# EAGLE design dekatron-sim-4017-a4 (EAGLE 7.6.0)
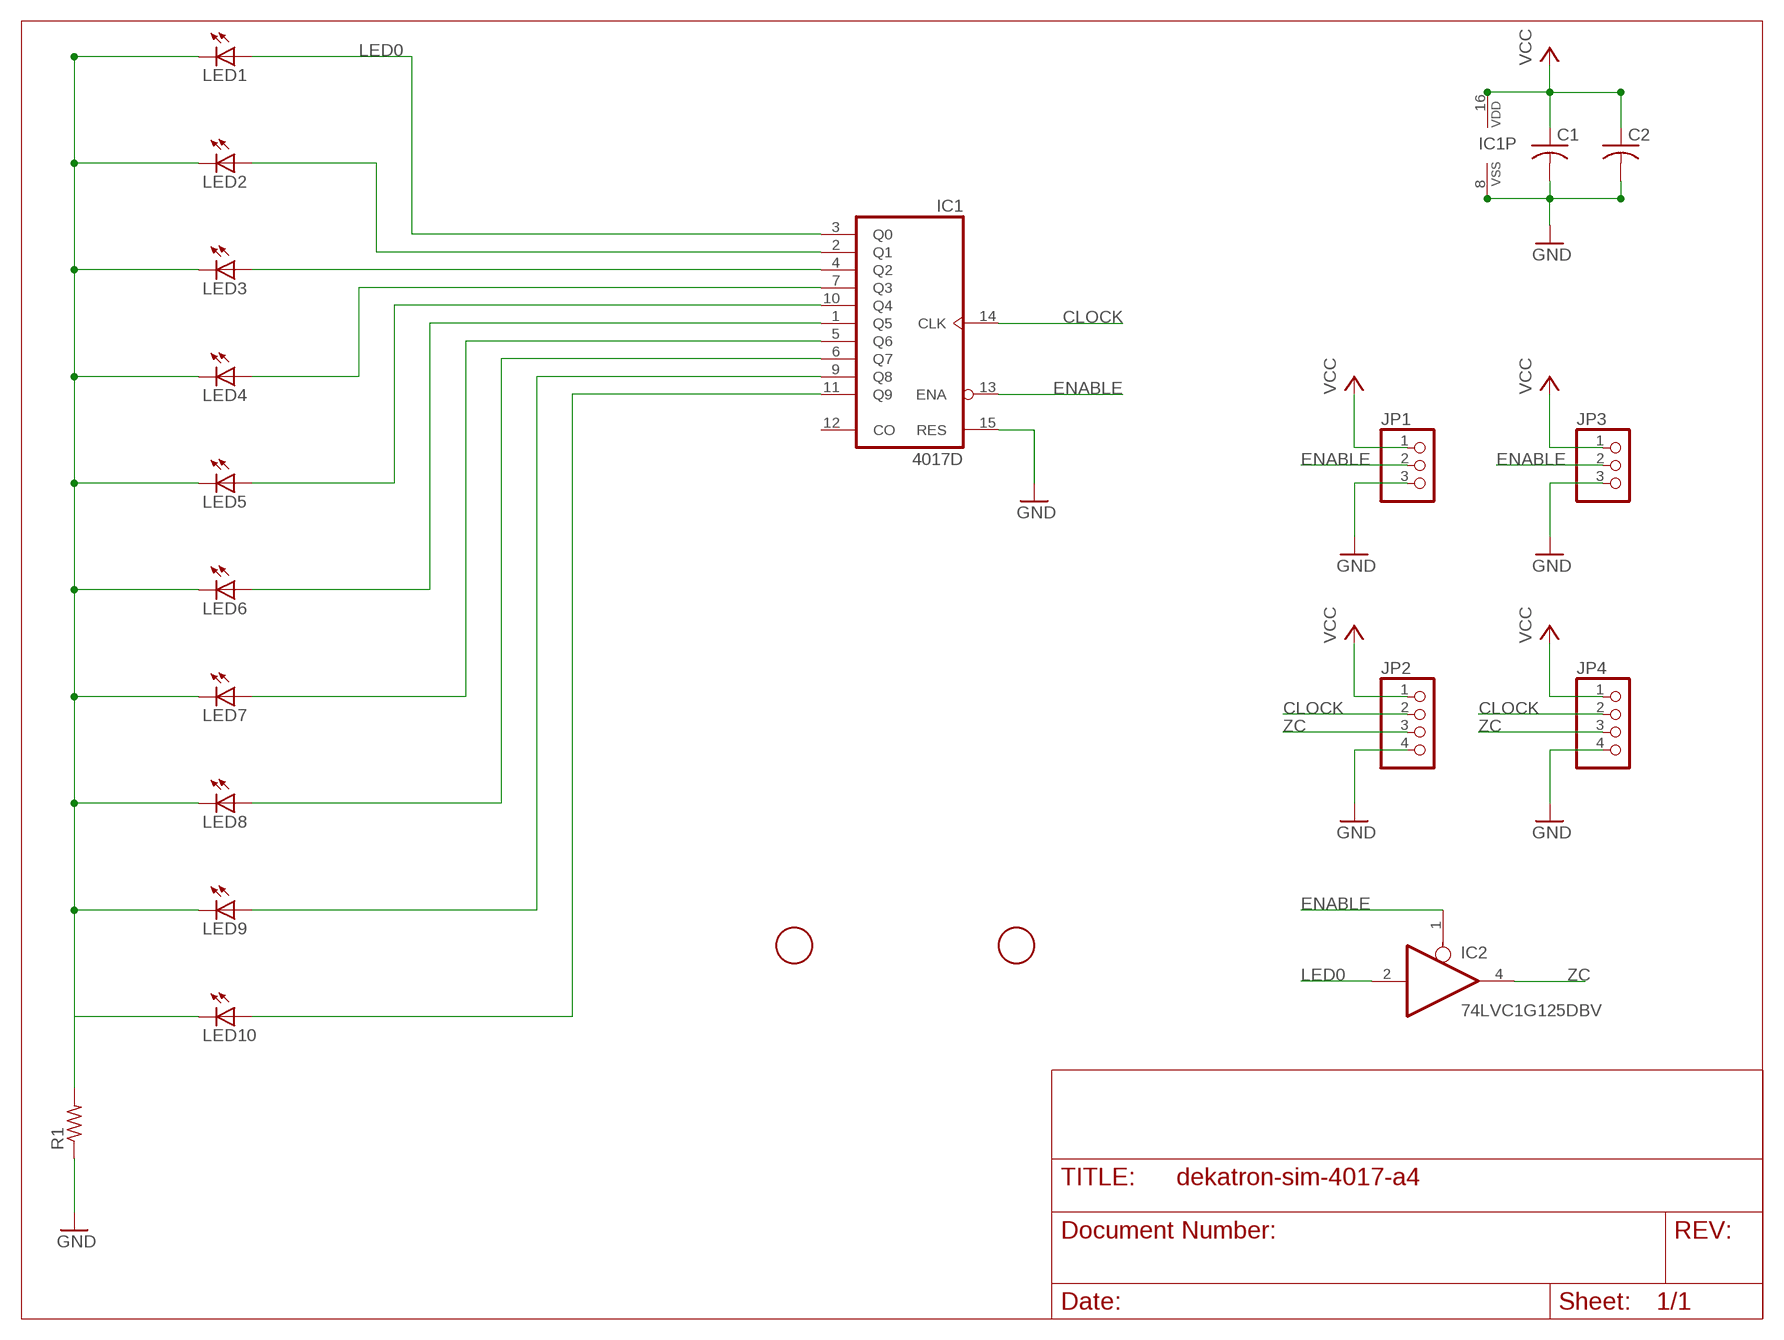
[diagram p0: schematic, sheet 1]

## Parts
C1  C-USC0805  [C0805]
C2  C-USC0805  [C0805]
FID1  FIDUCIAL  [FIDUCIAL_1MM]
FID2  FIDUCIAL  [FIDUCIAL_1MM]
IC1  4017D  [SO16]
IC2  74LVC1G125DBV  [SOT23-5]
JP1  PINHD-1X3  [1X03]
JP2  PINHD-1X4  [1X04]
JP3  PINHD-1X3  [1X03]
JP4  PINHD-1X4  [1X04]
LED1  RED  LEDCHIP-LED0805  [CHIP-LED0805]
LED2  RED  LEDCHIP-LED0805  [CHIP-LED0805]
LED3  RED  LEDCHIP-LED0805  [CHIP-LED0805]
LED4  RED  LEDCHIP-LED0805  [CHIP-LED0805]
LED5  RED  LEDCHIP-LED0805  [CHIP-LED0805]
LED6  RED  LEDCHIP-LED0805  [CHIP-LED0805]
LED7  RED  LEDCHIP-LED0805  [CHIP-LED0805]
LED8  RED  LEDCHIP-LED0805  [CHIP-LED0805]
LED9  RED  LEDCHIP-LED0805  [CHIP-LED0805]
LED10  RED  LEDCHIP-LED0805  [CHIP-LED0805]
R1  R-US_R0805  [R0805]

## Nets
CLOCK: IC1.14(CLK) JP2.2 JP4.2
ENABLE: IC1.13(ENA) IC2.1(OE) JP1.2 JP3.2
GND: C1.2 C2.2 IC1.8(VSS) IC1.15(RES) JP1.3 JP2.4 JP3.3 JP4.4 R1.1
LED0: IC1.3(Q0) IC2.2(I) LED1.A
LED1: IC1.2(Q1) LED2.A
LED3: IC1.7(Q3) LED4.A
LED4: IC1.10(Q4) LED5.A
LED5: IC1.1(Q5) LED6.A
LED6: IC1.5(Q6) LED7.A
LED7: IC1.6(Q7) LED8.A
LED8: IC1.9(Q8) LED9.A
LED9: IC1.11(Q9) LED10.A
LED_SINK: LED1.C LED2.C LED3.C LED4.C LED5.C LED6.C LED7.C LED8.C LED9.C LED10.C R1.2
N$1: IC1.4(Q2) LED3.A
VCC: C1.1 C2.1 IC1.16(VDD) JP1.1 JP2.1 JP3.1 JP4.1
ZC: IC2.4(O) JP2.3 JP4.3
Unconnected: IC1.12(CO)

## Power pins joined to a net without a drawn wire
GND: IC2.3(GND)
VCC: IC2.5(VCC)

## Library data of the parts
C1 C2 = resistor:C-US: CAPACITOR, American symbol
FID1 FID2 = adafruit:FIDUCIAL: For use by pick and place machines to calibrate the vision/machine, 1mm By microbuilder.eu
IC1 = 40xx:4017: COUNTER/DIVIDER
IC2 = 74xx-little-us:74*1G125: Single Bus Buffer Gate with 3-State Output
JP1 JP3 = pinhead:PINHD-1X3: PIN HEADER
JP2 JP4 = pinhead:PINHD-1X4: PIN HEADER
LED1-LED10 = led:LED: LED OSRAM: - CHIPLED LG R971, LG N971, LY N971, LG Q971, LY Q971, LO R971, LY R971 LH N974, LH R974 LS Q976, LO Q976, LY Q976 LO Q996 - Hyper CHIPLED LW Q18S LB Q993, LB Q99A, LB R99A - SideLED LS A670, LO A670, LY A670, LG A670, LP A670 LB A673, LV A673, LT A673, LW A673 LH A674 LY A675 LS A676, LA A676, LO A676, LY A676, LW A676 LS A679, LY A679, LG A679 - Hyper Micro SIDELED® LS Y876, LA Y876, LO Y876, LY Y876 LT Y87S - SmartLED LW L88C, LW L88S LB L89C, LB L89S, LG L890 LS L89K, LO L89K, LY L89K LS L896, LA L896, LO L896, LY L896 - TOPLED LS T670, LO T670, LY T670, LG T670, LP T670 LSG T670, LSP T670, LSY T670, LOP T670, LYG T670 LG T671, LOG T671, LSG T671 LB T673, LV T673, LT T673, LW T673 LH T674 LS T676, LA T676, LO T676, LY T676, LB T676, LH T676, LSB T676, LW T676 LB T67C, LV T67C, LT T67C, LS T67K, LO T67K, LY T67K, LW E67C LS E67B, LA E67B, LO E67B, LY E67B, LB E67C, LV E67C, LT E67C LW T67C LS T679, LY T679, LG T679 LS T770, LO T770, LY T770, LG T770, LP T770 LB T773, LV T773, LT T773, LW T773 LH T774 LS E675, LA E675, LY E675, LS T675 LS T776, LA T776, LO T776, LY T776, LB T776 LHGB T686 LT T68C, LB T68C - Hyper Mini TOPLED® LB M676 - Mini TOPLED Santana® LG M470 LS M47K, LO M47K, LY M47K Source: http://www.osram.convergy.de LUXEON: - LUMILED® LXK2-PW12-R00, LXK2-PW12-S00, LXK2-PW14-U00, LXK2-PW14-V00 LXK2-PM12-R00, LXK2-PM12-S00, LXK2-PM14-U00 LXK2-PE12-Q00, LXK2-PE12-R00, LXK2-PE12-S00, LXK2-PE14-T00, LXK2-PE14-U00 LXK2-PB12-K00, LXK2-PB12-L00, LXK2-PB12-M00, LXK2-PB14-N00, LXK2-PB14-P00, LXK2-PB14-Q00 LXK2-PR12-L00, LXK2-PR12-M00, LXK2-PR14-Q00, LXK2-PR14-R00 LXK2-PD12-Q00, LXK2-PD12-R00, LXK2-PD12-S00 LXK2-PH12-R00, LXK2-PH12-S00 LXK2-PL12-P00, LXK2-PL12-Q00, LXK2-PL12-R00 Source: www.luxeon.com KINGBRIGHT: KA-3528ASYC Source: www.kingbright.com
R1 = resistor:R-US_: RESISTOR, American symbol

## Board
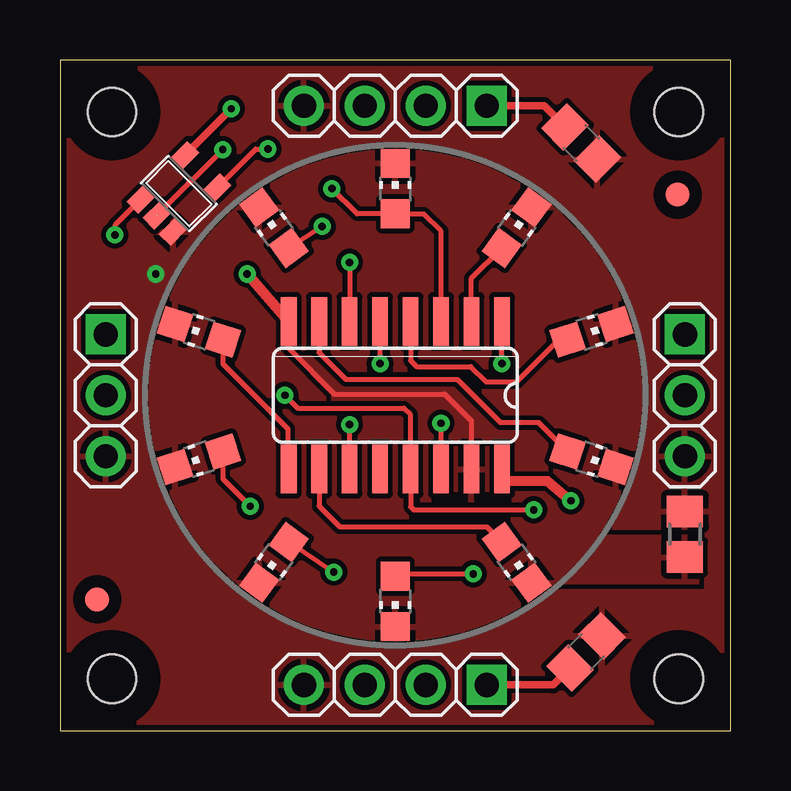
[diagram p1: board, top side]
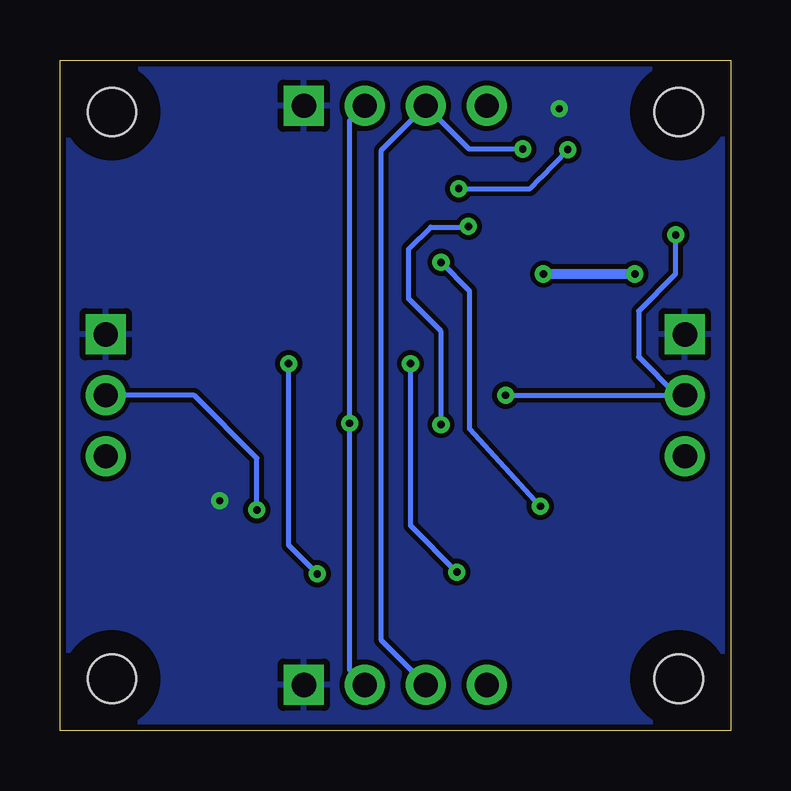
[diagram p2: board, bottom side, seen from below]

Size 27.94 x 27.94 mm. Coordinates in mm from the lower left corner, seen from the top.
Outline: 27.94,27.94 0,27.94 0,0 27.94,0 27.94,27.94
Copper layers (1*16): Top 0.035mm / dielectric 1.5mm / Bottom 0.035mm
Design rules "default *": minimum track width 8mil, minimum drill 12mil, track to track 8mil, track to pad 10mil, pad to pad 10mil, via to via 8mil, smd to smd 8mil, copper to edge 10mil, drill to drill 8mil, minimum pad ring 10mil, minimum via ring 8mil, stop-mask expansion 4mil, vias tented up to drill 0mil, thermal gap 10mil
Holes 2.01 mm at 2.16,2.16 25.78,2.16 25.78,25.78 2.16,25.78
tRestrict: area 23.8,0.2 to 27.8,4.2; area 23.8,23.8 to 27.8,27.8; area 0.2,23.8 to 4.2,27.8; area 0.2,0.2 to 4.2,4.2
bRestrict: area 23.8,0.2 to 27.8,4.2; area 23.8,23.8 to 27.8,27.8; area 0.2,23.8 to 4.2,27.8; area 0.2,0.2 to 4.2,4.2

### Footprints (pad centres in the part's own frame; a part is rotated, then mirrored left to right if it is on the bottom)
C0805 = smd 1.3 x 1.5: 1 -0.95,0; 2 0.95,0
FIDUCIAL_1MM = smd 1 x 1: 1 0,0
SO16 = smd 0.66 x 2.032: 1 -4.445,-3.073; 2 -3.175,-3.073; 3 -1.905,-3.073; 4 -0.635,-3.073; 5 0.635,-3.073; 6 1.905,-3.073; 7 3.175,-3.073; 8 4.445,-3.073; 9 4.445,3.073; 10 3.175,3.073; 11 1.905,3.073; 12 0.635,3.073; 13 -0.635,3.073; 14 -1.905,3.073; 15 -3.175,3.073; 16 -4.445,3.073
SOT23-5 = smd 0.69 x 0.99: 1 -0.95,-1.29; 2 0,-1.29; 3 0.95,-1.29; 4 0.95,1.3; 5 -0.95,1.3
1X03 = drill 1.016 pad 1.676 square: 1 -2.54,0 | drill 1.016 pad 1.676: 2 0,0; 3 2.54,0
1X04 = drill 1.016 pad 1.676 square: 1 -3.81,0 | drill 1.016 pad 1.676: 2 -1.27,0; 3 1.27,0; 4 3.81,0
CHIP-LED0805 = smd 1.2 x 1.2: A 0,-1.05; C 0,1.05
R0805 = smd 1.3 x 1.5: 1 -0.95,0; 2 0.95,0

### Placement (x,y rotation side)
C1  21.72,24.49 315 top
C2  21.92,3.28 45 top
FID1  25.73,22.33 0 top
FID2  1.55,5.46 0 top
IC1  13.97,13.97 180 top
IC2  4.95,22.38 315 top
JP1  1.91,13.97 270 top
JP2  13.97,26.04 180 top
JP3  26.04,13.97 270 top
JP4  13.97,1.91 180 top
LED1  13.97,22.58 0 top
LED2  19.02,20.95 324 top
LED3  22.15,16.61 288 top
LED4  22.15,11.3 252 top
LED5  19.02,7.01 216 top
LED6  13.97,5.38 180 top
LED7  8.92,7.01 144 top
LED8  5.79,11.3 108 top
LED9  5.79,16.61 72 top
LED10  8.92,20.95 36 top
R1  26.04,8.18 270 top

### Tracks (layer width: path | path; a pad name or v marks a point on that pad's centre or on a via)
CLOCK  (via drill 0.3)
  Top 0.203: IC1.14 v15.88,12.8
  Bottom 0.203: JP4.2 15.88,2.52 v15.88,12.8 15.88,25.43 JP2.2
ENABLE  (via drill 0.3)
  Top 0.203: v19.74,9.2 14.73,9.2 14.61,9.32 IC1.13 14.61,13.16 14.33,13.44 9.91,13.44 v9.37,13.97 | IC2.1 2.29,21.05 v2.29,20.65
  Bottom 0.203: 2.72,13.97 JP1.2 | v9.37,13.97 JP1.2 | JP1.2 2.39,13.97 | v19.74,9.2 19.74,11.35 22.35,13.97 JP3.2 | JP1.2 2.23,13.97 3.83,15.57 3.83,17.48 2.29,19.02 v2.29,20.65
GND  (via drill 0.3)
  Top 0.203: IC1.8 9.53,15.93 11.43,14.02 16.03,14.02 17.14,12.9 IC1.15
  Top 0.406: IC1.8 v7.8,19.02
  Bottom 0.406: v7.8,19.02 v3.99,19.02
  pour Top (rank 6): 27.69,0.25 0.25,0.25 0.25,27.69 27.69,27.69
LED0  (via drill 0.3)
  Top 0.203: IC1.3 15.88,20.8 15.16,21.51 13.99,21.51 LED1.A 12.38,21.53 v11.33,22.58 | IC2.2 v6.78,24.21
  Bottom 0.203: v6.78,24.21 7.9,23.04 8.36,22.58 v11.33,22.58
LED1
  Top 0.203: IC1.2 17.14,18.84 LED2.A
LED3
  Top 0.203: IC1.7 10.79,15.75 11.91,14.63 16.56,14.63 18.36,12.83 19.95,12.83 LED4.A
LED4
  Top 0.203: IC1.10 10.79,9.35 11.66,8.48 17.78,8.48 LED5.A
LED5  (via drill 0.3)
  Top 0.203: LED6.A 14.06,6.53 v17.22,6.53 | v18.41,15.29 IC1.1
  Bottom 0.203: v17.22,6.53 18.41,7.72 v18.41,15.29
LED6  (via drill 0.3)
  Top 0.203: LED7.A v11.4,6.6 | v13.34,15.29 IC1.5
  Bottom 0.203: v11.4,6.6 13.34,8.53 v13.34,15.29
LED7  (via drill 0.3)
  Top 0.203: LED8.A 6.79,10.48 v7.92,9.35 | v12.06,19.51 IC1.6
  Bottom 0.203: v7.92,9.35 10.87,12.57 10.87,18.31 v12.06,19.51
LED8
  Top 0.203: LED9.A 6.79,15.28 9.5,12.57 9.5,10.92 IC1.9
LED9  (via drill 0.3)
  Top 0.203: IC1.11 v12.06,12.75 | v10.92,21.01 LED10.A
  Bottom 0.203: v12.06,12.75 12.06,16.64 13.41,17.98 13.41,20.07 12.5,20.98 10.95,20.98 v10.92,21.01
LED_SINK
  pour Top: 26.54,8.05 26.54,6.2 20.6,6.2 20.6,8.05
  pour Top (rank 4): 13.97,24.13 arc-90 24.13,13.97 arc-90 13.97,3.81 arc-90 3.81,13.97 arc-90
N$1
  Top 0.203: IC1.4 14.61,15.42 14.86,15.16 17.12,15.16 17.75,14.53 19.02,14.53 20.78,16.29 LED3.A
VCC  (via drill 0.3)
  Top 0.305: C2.1 20.55,1.91 JP4.1 | C1.1 20.17,26.04 JP2.1 | IC2.5 6.71,25.47 v7.14,25.91
  Top 0.406: v21.29,9.58 20.32,10.39 18.41,10.39 IC1.16
  pour Bottom: 27.69,0.25 0.25,0.25 0.25,27.69 27.69,27.69
ZC  (via drill 0.3)
  Top 0.203: IC2.4 8.15,24.23 v8.66,24.23
  Bottom 0.203: 12.68,26.01 JP2.3 | JP4.3 14.55,3.76 14.55,24.18 JP2.3 | v8.66,24.23 10.9,24.23 JP2.3

### Text on the board
Document: 0 | 9 | 1 | 8 | 2 | 7 | 3 | 6 | 4 | 5 | DEKATRON / SIMULATOR